# Altium schematic sheet Power.SchDoc
size A4; SheetNumber: 2; SheetTotal: 4
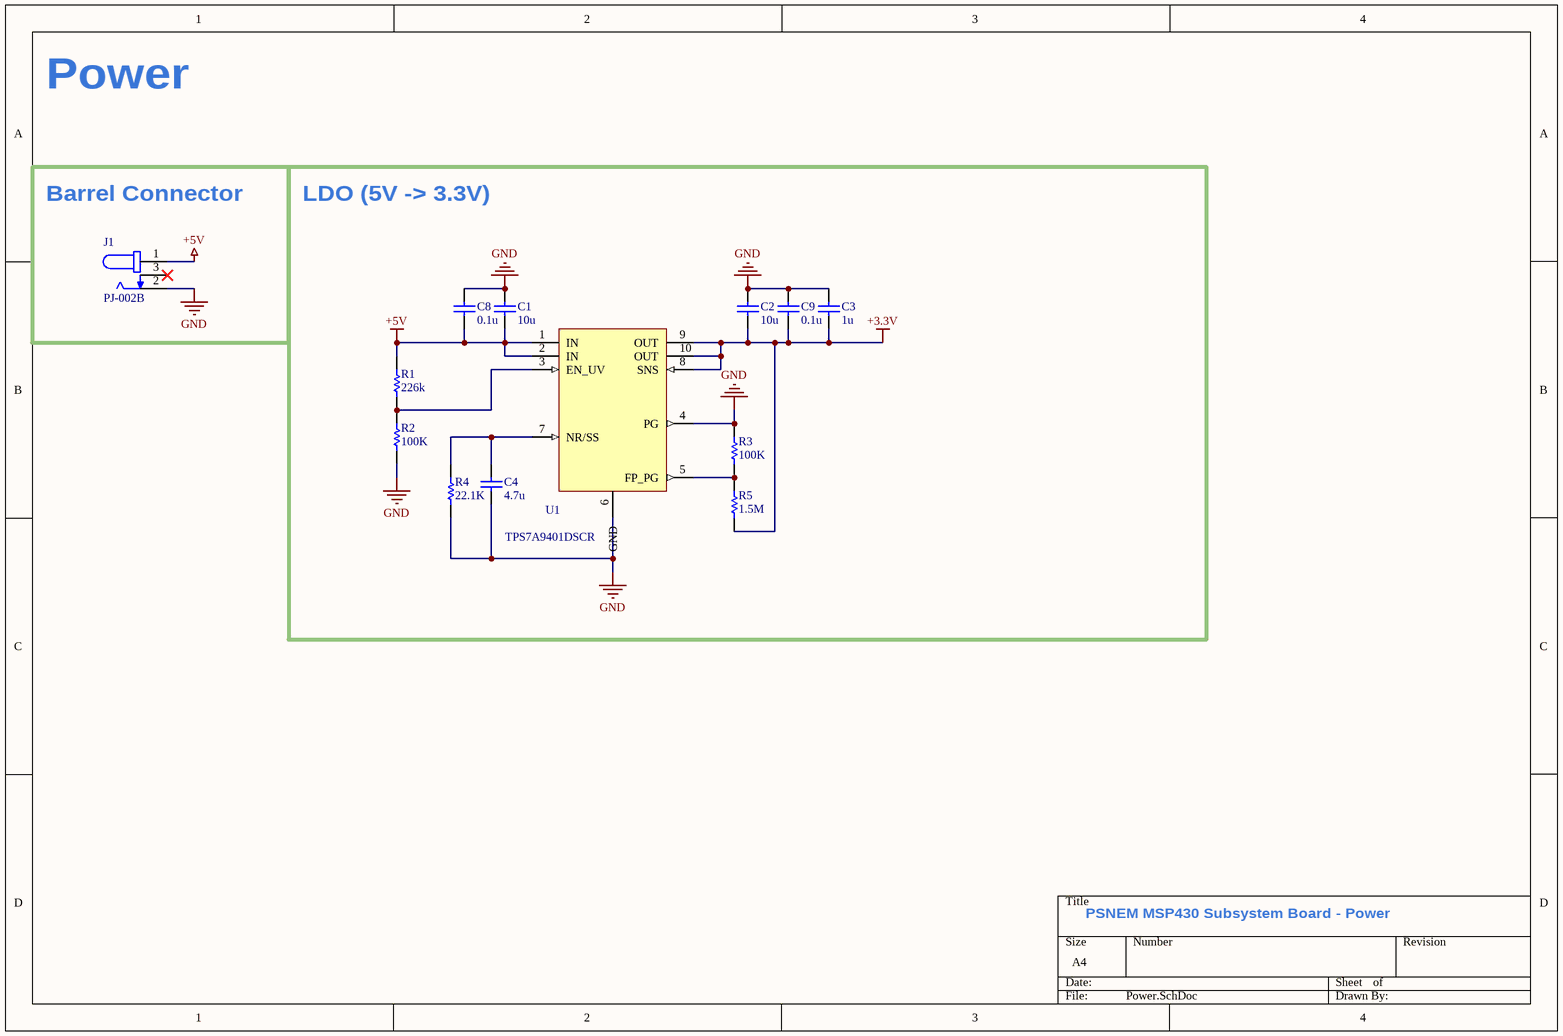
[diagram p0: Power.SchDoc]

## Parts
C1  10u  [0805 Cap]
C2  10u  [0805 Cap]
C3  1u  [0805 Cap]
C4  4.7u  [0805 Cap]
C8  0.1u  [0805 Cap]
C9  0.1u  [0805 Cap]
J1  PJ-002B  [PJ-002B]
R1  226k  [RESC1608X06N]
R2  100K  [RESC1608X06N]
R3  100K  [RESC1608X06N]
R4  22.1K  [RESC1608X06N]
R5  1.5M  [RESC1608X06N]
U1  TPS7A9401DSCR  [TPS7A9401DSCR]

## Blocks framed on the sheet
Barrel Connector: J1
LDO (5V -> 3.3V): C1-C4 C8 C9 R1-R5 U1

## Nets
+3.3V: C2.1 C3.2 C9.1 R5.1 U1.8(SNS) U1.9(OUT) U1.10(OUT)
+5V: C1.1 C8.2 J1.1 R1.2 U1.1(IN) U1.2(IN)
GND: C1.2 C2.2 C3.1 C4.1 C8.1 C9.2 J1.2 R2.1 R3.2 R4.1 U1.4(PG)
NetC4_2: C4.2 R4.2 U1.7(NR/SS)
NetR1_1: R1.1 R2.2 U1.3(EN_UV)
NetR3_1: R3.1 R5.2 U1.5(FP_PG)

Not connected (* = marked no-connect by the designer): J1 3*; U1 6(GND)

## Notes on the sheet
- Power
- PSNEM MSP430 Subsystem Board - Power

## Library data of the parts
C1 C2 = CL21B106KPQNNNE: 10 µF ±10% 10V Ceramic Capacitor X7R 0805 (2012 Metric); value: 10u
C3 = CC0805KKX7R7BB105: 1 µF ±10% 16V Ceramic Capacitor X7R 0805 (2012 Metric); value: 1u
C4 = CL21B475KOFNFNE: 4.7 µF ±10% 16V Ceramic Capacitor X7R 0805 (2012 Metric); value: 4.7u
C8 C9 = CC0805KRX7R9BB104: 0.1 µF ±10% 50V Ceramic Capacitor X7R 0805 (2012 Metric); value: 0.1u
J1 = PJ-002B: Power Barrel Connector Jack 2.50mm ID (0.098"), 5.50mm OD (0.217") Through Hole, Right Angle
R1 = RN73H1JTTD2263B25: Thin Film Resistors - SMD 226kOhm,0603,0.1%,25; value: 226k
R2 R3 = ERA-3VRW1003V: Thin Film Resistors - SMD 0603 0.05% 100Kohm 10ppm SMD; value: 100K
R4 = TNPW060322K1BEEA: Thin Film Resistors - SMD 22.1Kohms .1% 25ppm; value: 22.1K
R5 = MCT0603MD1504BP500: Thin Film Resistors - SMD .125W 1.5Mohms .1% 0603 25ppm; value: 1.5M
U1 = TPS7A9401DSCR: Linear Voltage Regulator IC Positive Adjustable 1 Output 1A 10-WSON (3x3); Manufacturer: Texas Instruments; Manufacturer PN: TPS7A9401DSCR